# Altium schematic sheet top_sheet.SchDoc
size A4; SheetNumber: 1; SheetTotal: 4
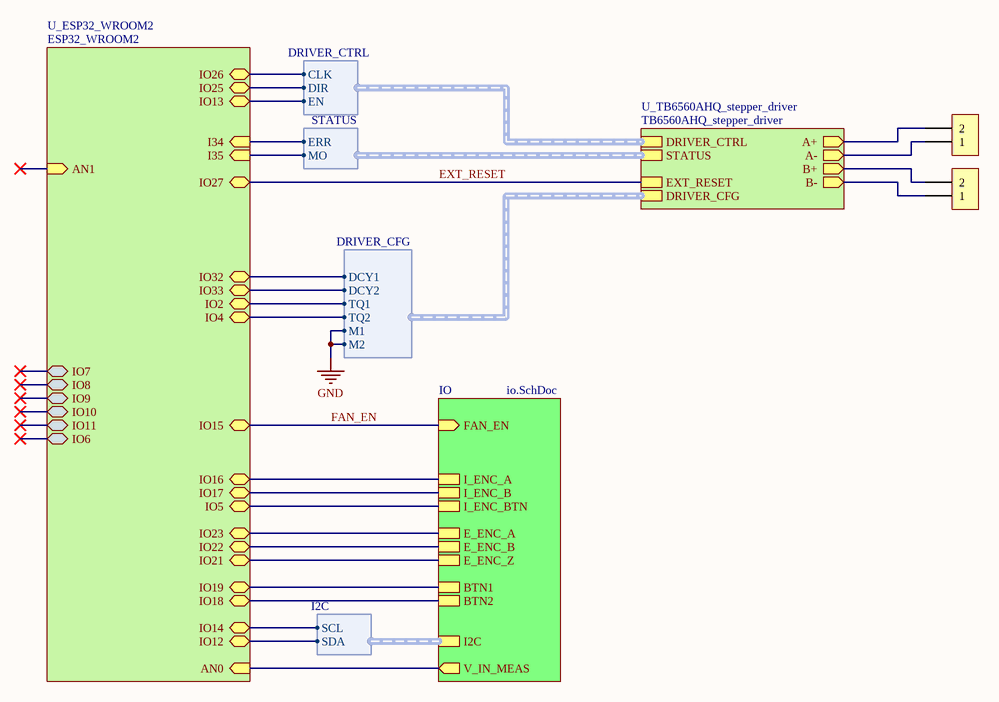
[diagram p0: top_sheet.SchDoc]

## Parts
STP1  TBLOCK-M2  [TBLOCK-M2]  (value not drawn)
STP2  TBLOCK-M2  [TBLOCK-M2]  (value not drawn)

## Sub-sheets
IO = io.SchDoc: I_ENC_B, E_ENC_B, E_ENC_Z, I_ENC_BTN, I_ENC_A, I2C (harness I2C), BTN1, BTN2, E_ENC_A, V_IN_MEAS (out), FAN_EN (in)
U_ESP32_WROOM2 = ESP32_WROOM2: IO25 (bidir), IO26 (bidir), IO27 (bidir), IO22 (bidir), IO23 (bidir), IO32 (bidir), IO19 (bidir), IO21 (bidir), IO33 (bidir), IO14 (bidir), IO12 (bidir), IO15 (bidir), IO16 (bidir), IO17 (bidir), IO18 (bidir), IO13 (bidir), I34 (in), I35 (in), IO5 (bidir), IO4 (bidir), IO2 (bidir), AN0 (in), AN1 (in), IO7 (bidir), IO8 (bidir), IO9 (bidir), IO10 (bidir), IO11 (bidir), IO6 (bidir)
U_TB6560AHQ_stepper_driver = TB6560AHQ_stepper_driver: DRIVER_CFG (harness DRIVER_CFG), DRIVER_CTRL (harness DRIVER_CTRL), STATUS (harness STATUS), A+ (out), A- (out), B+ (out), B- (out), EXT_RESET

## Harnesses
STATUS: ERR, MO
DRIVER_CTRL: CLK, DIR, EN
I2C: SCL, SDA
DRIVER_CFG: DCY1, DCY2, M1, M2, TQ1, TQ2

## Nets
GND: sheet U_TB6560AHQ_stepper_driver/DRIVER_CFG.M1, sheet U_TB6560AHQ_stepper_driver/DRIVER_CFG.M2
EXT_RESET: sheet U_TB6560AHQ_stepper_driver/EXT_RESET, sheet U_ESP32_WROOM2/IO27
FAN_EN: sheet U_ESP32_WROOM2/IO15, sheet IO/FAN_EN
NetSTP1_1: STP1.1 ; sheet U_TB6560AHQ_stepper_driver/A-
NetSTP1_2: STP1.2 ; sheet U_TB6560AHQ_stepper_driver/A+
NetSTP2_1: STP2.1 ; sheet U_TB6560AHQ_stepper_driver/B-
NetSTP2_2: STP2.2 ; sheet U_TB6560AHQ_stepper_driver/B+
(unnamed): sheet U_ESP32_WROOM2/IO25, sheet U_TB6560AHQ_stepper_driver/DRIVER_CTRL.DIR
(unnamed): sheet U_ESP32_WROOM2/IO26, sheet U_TB6560AHQ_stepper_driver/DRIVER_CTRL.CLK
(unnamed): sheet U_ESP32_WROOM2/IO22, sheet IO/E_ENC_B
(unnamed): sheet U_ESP32_WROOM2/IO23, sheet IO/E_ENC_A
(unnamed): sheet U_ESP32_WROOM2/IO32, sheet U_TB6560AHQ_stepper_driver/DRIVER_CFG.DCY1
(unnamed): sheet U_ESP32_WROOM2/IO19, sheet IO/BTN1
(unnamed): sheet U_ESP32_WROOM2/IO21, sheet IO/E_ENC_Z
(unnamed): sheet U_ESP32_WROOM2/IO33, sheet U_TB6560AHQ_stepper_driver/DRIVER_CFG.DCY2
(unnamed): sheet U_ESP32_WROOM2/IO14, sheet IO/I2C.SCL
(unnamed): sheet U_ESP32_WROOM2/IO12, sheet IO/I2C.SDA
(unnamed): sheet U_ESP32_WROOM2/IO16, sheet IO/I_ENC_A
(unnamed): sheet U_ESP32_WROOM2/IO17, sheet IO/I_ENC_B
(unnamed): sheet U_ESP32_WROOM2/IO18, sheet IO/BTN2
(unnamed): sheet U_ESP32_WROOM2/IO13, sheet U_TB6560AHQ_stepper_driver/DRIVER_CTRL.EN
(unnamed): sheet U_ESP32_WROOM2/I34, sheet U_TB6560AHQ_stepper_driver/STATUS.ERR
(unnamed): sheet U_ESP32_WROOM2/I35, sheet U_TB6560AHQ_stepper_driver/STATUS.MO
(unnamed): sheet U_ESP32_WROOM2/IO5, sheet IO/I_ENC_BTN
(unnamed): sheet U_ESP32_WROOM2/IO4, sheet U_TB6560AHQ_stepper_driver/DRIVER_CFG.TQ2
(unnamed): sheet U_ESP32_WROOM2/IO2, sheet U_TB6560AHQ_stepper_driver/DRIVER_CFG.TQ1
(unnamed): sheet U_ESP32_WROOM2/AN0, sheet IO/V_IN_MEAS